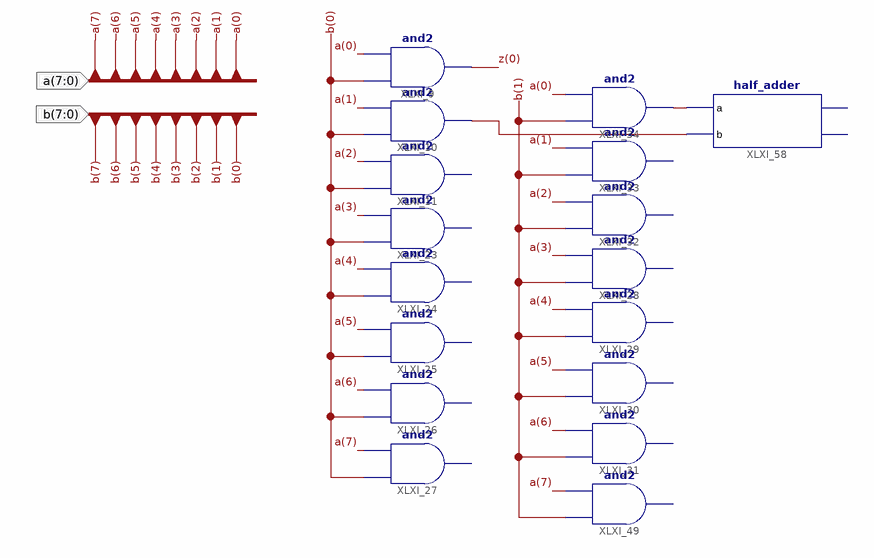
[diagram p0: schematic sheet 1]
// Xilinx ISE schematic eight_bit_multiplier.sch (spartan6) as structural Verilog: 17 symbols, 2 ports
module eight_bit_multiplier (
  input  [7:0] a,
  input  [7:0] b
);

  wire XLXN_79, XLXN_80;
  wire [0:0] z;

  and XLXI_9 (z[0], b[0], a[0]);
  and XLXI_10 (XLXN_79, b[0], a[1]);
  // and2 XLXI_11 has open pins: I0=b[0], I1=a[2], O=open
  // and2 XLXI_23 has open pins: I0=b[0], I1=a[3], O=open
  // and2 XLXI_24 has open pins: I0=b[0], I1=a[4], O=open
  // and2 XLXI_25 has open pins: I0=b[0], I1=a[5], O=open
  // and2 XLXI_26 has open pins: I0=b[0], I1=a[6], O=open
  // and2 XLXI_27 has open pins: I0=b[0], I1=a[7], O=open
  // and2 XLXI_28 has open pins: I0=b[1], I1=a[3], O=open
  // and2 XLXI_29 has open pins: I0=b[1], I1=a[4], O=open
  // and2 XLXI_30 has open pins: I0=b[1], I1=a[5], O=open
  // and2 XLXI_31 has open pins: I0=b[1], I1=a[6], O=open
  // and2 XLXI_32 has open pins: I0=b[1], I1=a[2], O=open
  // and2 XLXI_33 has open pins: I0=b[1], I1=a[1], O=open
  and XLXI_34 (XLXN_80, b[1], a[0]);
  // and2 XLXI_49 has open pins: I0=b[1], I1=a[7], O=open
  half_adder XLXI_58 (.a(XLXN_80), .b(XLXN_79));  // open: sum, carryout
endmodule
